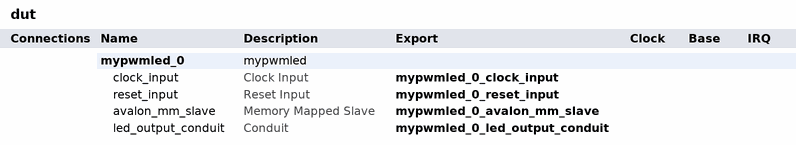
[diagram p0: system contents]
# Platform Designer (Qsys) system dut, Cyclone V 5CSXFC6C6U23C8ES
# Parameters at their usual value, and those the tool derives, are not listed.
package require qsys
create_system dut
set_project_property DEVICE_FAMILY {Cyclone V}
set_project_property DEVICE 5CSXFC6C6U23C8ES

add_instance mypwmled_0 mypwmled 1.0
set_instance_parameter_value mypwmled_0 scratchreg_on_reset 3233857728

# exported interfaces
add_interface mypwmled_0_avalon_mm_slave avalon slave
set_interface_property mypwmled_0_avalon_mm_slave EXPORT_OF mypwmled_0.avalon_mm_slave
add_interface mypwmled_0_reset_input reset sink
set_interface_property mypwmled_0_reset_input EXPORT_OF mypwmled_0.reset_input
add_interface mypwmled_0_clock_input clock sink
set_interface_property mypwmled_0_clock_input EXPORT_OF mypwmled_0.clock_input
add_interface mypwmled_0_led_output_conduit conduit end
set_interface_property mypwmled_0_led_output_conduit EXPORT_OF mypwmled_0.led_output_conduit

set_interconnect_requirement {$system} qsys_mm.clockCrossingAdapter HANDSHAKE
set_interconnect_requirement {$system} qsys_mm.maxAdditionalLatency 1
set_interconnect_requirement {$system} qsys_mm.insertDefaultSlave false

save_system dut.qsys
